# Altium schematic sheet Interfaces_Isolation.SchDoc
size 508 x 292 mm; SheetNumber: 3; SheetTotal: 8
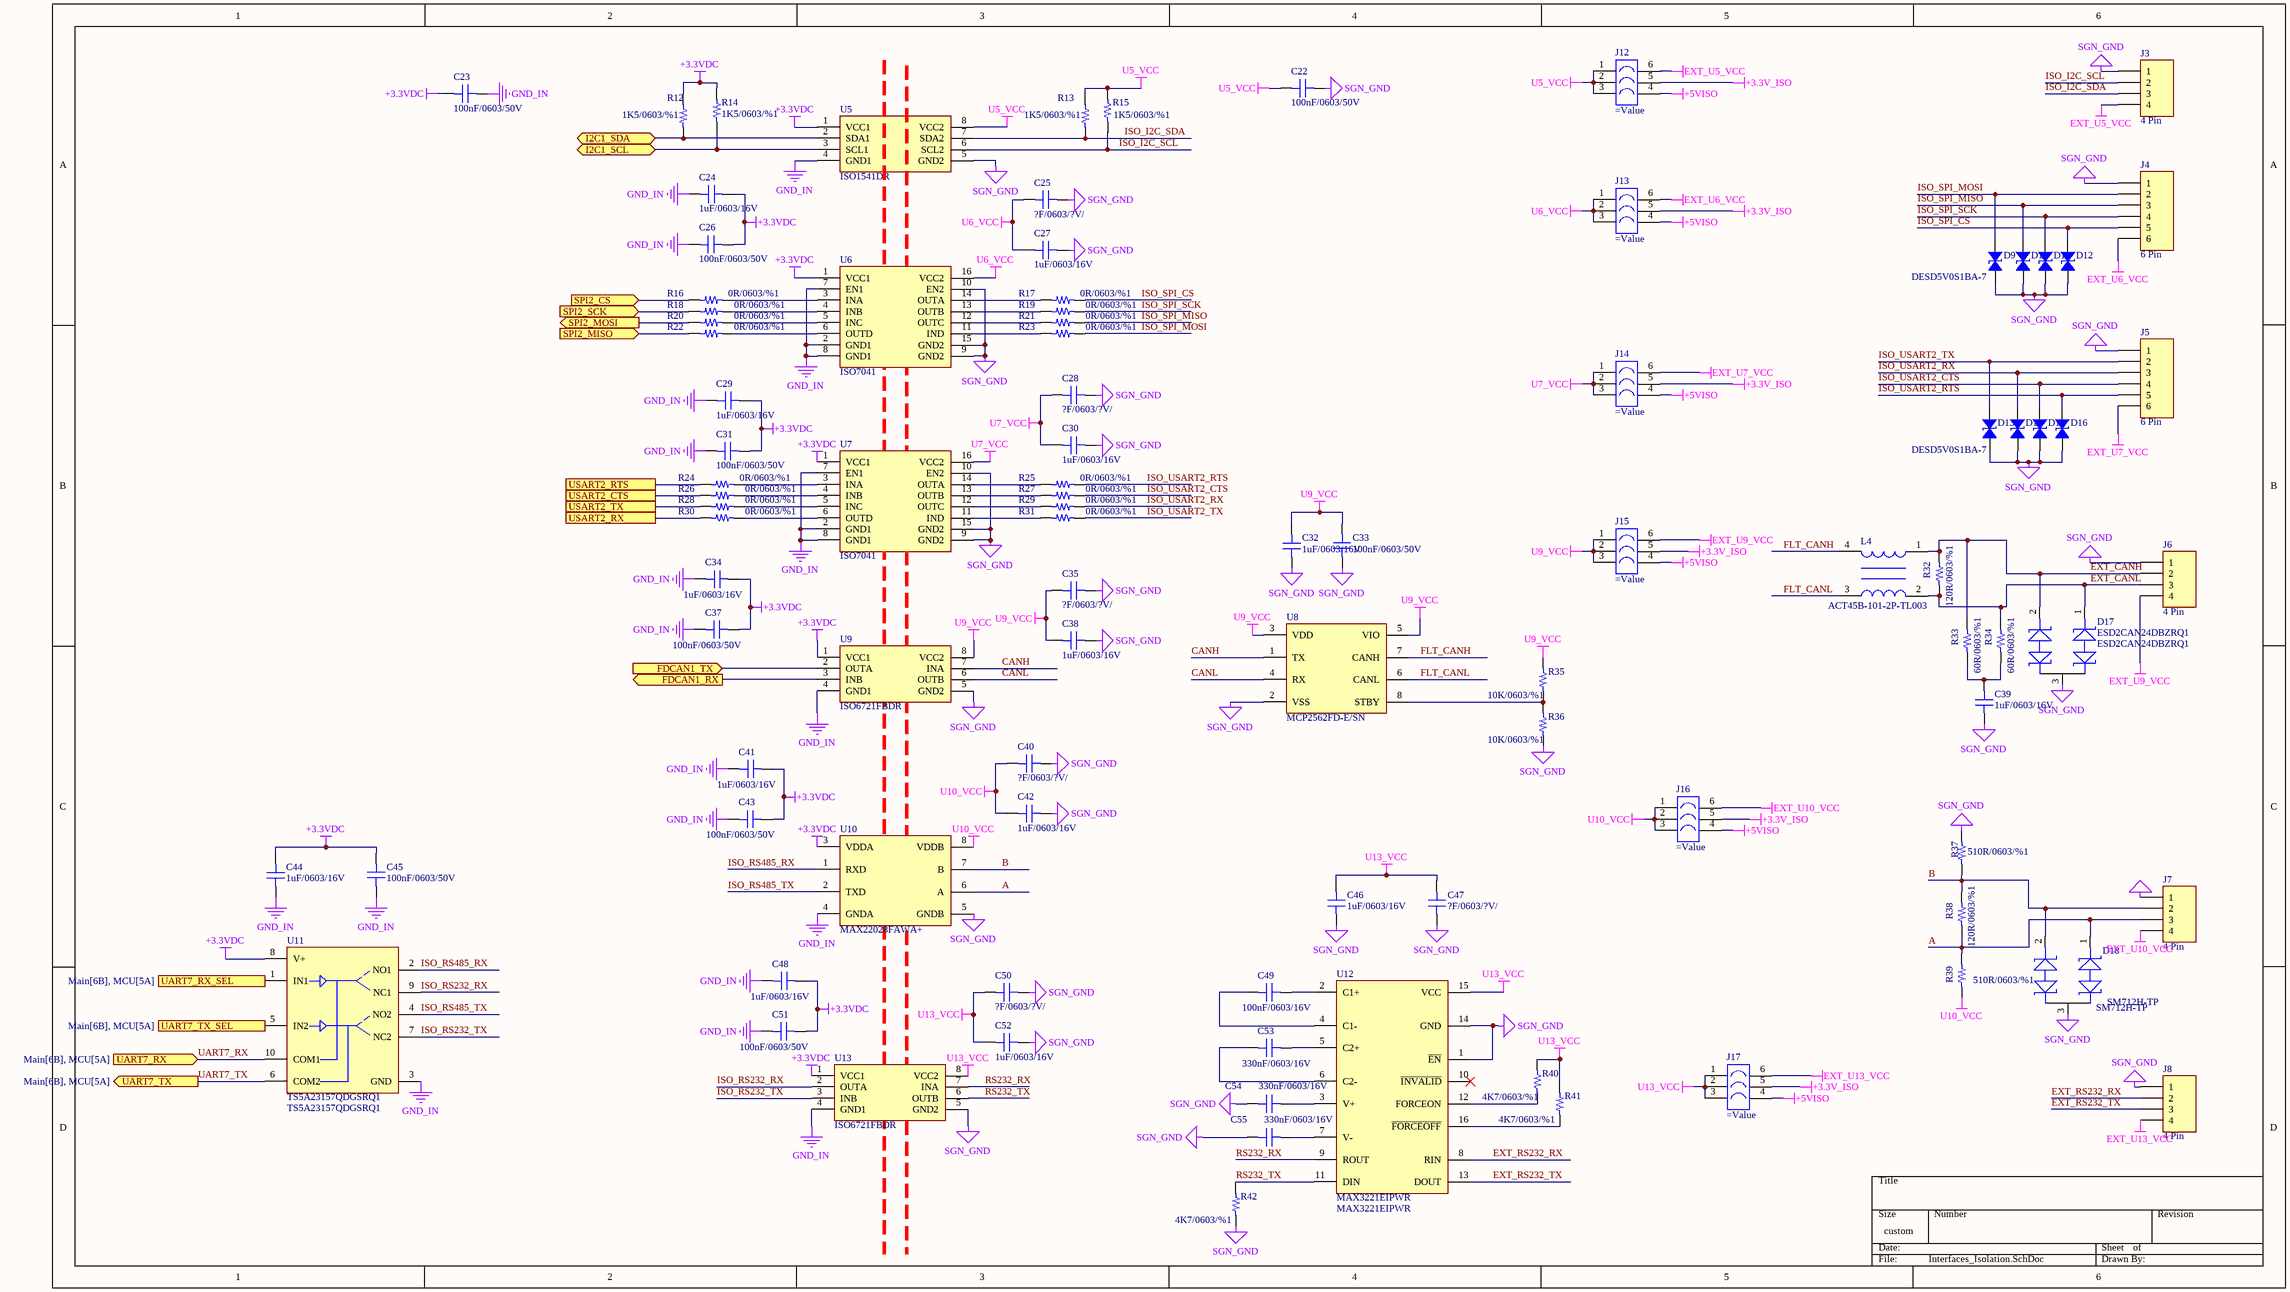
[diagram p0: Interfaces_Isolation.SchDoc]

## Parts
C22  100nF/0603/50V  [0603_cap]
C23  100nF/0603/50V  [0603_cap]
C24  1uF/0603/16V  [0603_cap]
C25  ?F/0603/?V/  [0603_cap]
C26  100nF/0603/50V  [0603_cap]
C27  1uF/0603/16V  [0603_cap]
C28  ?F/0603/?V/  [0603_cap]
C29  1uF/0603/16V  [0603_cap]
C30  1uF/0603/16V  [0603_cap]
C31  100nF/0603/50V  [0603_cap]
C32  1uF/0603/16V  [0603_cap]
C33  100nF/0603/50V  [0603_cap]
C34  1uF/0603/16V  [0603_cap]
C35  ?F/0603/?V/  [0603_cap]
C37  100nF/0603/50V  [0603_cap]
C38  1uF/0603/16V  [0603_cap]
C39  1uF/0603/16V  [0603_cap]
C40  ?F/0603/?V/  [0603_cap]
C41  1uF/0603/16V  [0603_cap]
C42  1uF/0603/16V  [0603_cap]
C43  100nF/0603/50V  [0603_cap]
C44  1uF/0603/16V  [0603_cap]
C45  100nF/0603/50V  [0603_cap]
C46  1uF/0603/16V  [0603_cap]
C47  ?F/0603/?V/  [0603_cap]
C48  1uF/0603/16V  [0603_cap]
C49  100nF/0603/16V  [0603_cap]
C50  ?F/0603/?V/  [0603_cap]
C51  100nF/0603/50V  [0603_cap]
C52  1uF/0603/16V  [0603_cap]
C53  330nF/0603/16V  [0603_cap]
C54  330nF/0603/16V  [0603_cap]
C55  330nF/0603/16V  [0603_cap]
D9  DESD5V0S1BA-7  [SOD323]
D10  DESD5V0S1BA-7  [SOD323]  (value not drawn)
D11  DESD5V0S1BA-7  [SOD323]  (value not drawn)
D12  DESD5V0S1BA-7  [SOD323]  (value not drawn)
D13  DESD5V0S1BA-7  [SOD323]
D14  DESD5V0S1BA-7  [SOD323]  (value not drawn)
D15  DESD5V0S1BA-7  [SOD323]  (value not drawn)
D16  DESD5V0S1BA-7  [SOD323]  (value not drawn)
D17  ESD2CAN24DBZRQ1  [TI SOT-23-3 DBZ]
D18  SM712H-TP  [TI SOT-23-3 DBZ]
J3  4 Pin  [R/A HEADER (4PİN)]
J4  6 Pin  [R/A HEADER]
J5  6 Pin  [R/A HEADER]
J6  4 Pin  [R/A HEADER (4PİN)]
J7  4 Pin  [R/A HEADER (4PİN)]
J8  4 Pin  [R/A HEADER (4PİN)]
J12  (no value)  [th_ra_6pins_1.27mm]
J13  (no value)  [th_ra_6pins_1.27mm]
J14  (no value)  [th_ra_6pins_1.27mm]
J15  (no value)  [th_ra_6pins_1.27mm]
J16  (no value)  [th_ra_6pins_1.27mm]
J17  (no value)  [th_ra_6pins_1.27mm]
L4  ACT45B-101-2P-TL003  [CMC((4.50mm x 3.20mm))]
R12  1K5/0603/%1  [0603_res]
R13  1K5/0603/%1  [0603_res]
R14  1K5/0603/%1  [0603_res]
R15  1K5/0603/%1  [0603_res]
R16  0R/0603/%1  [0603_res]
R17  0R/0603/%1  [0603_res]
R18  0R/0603/%1  [0603_res]
R19  0R/0603/%1  [0603_res]
R20  0R/0603/%1  [0603_res]
R21  0R/0603/%1  [0603_res]
R22  0R/0603/%1  [0603_res]
R23  0R/0603/%1  [0603_res]
R24  0R/0603/%1  [0603_res]
R25  0R/0603/%1  [0603_res]
R26  0R/0603/%1  [0603_res]
R27  0R/0603/%1  [0603_res]
R28  0R/0603/%1  [0603_res]
R29  0R/0603/%1  [0603_res]
R30  0R/0603/%1  [0603_res]
R31  0R/0603/%1  [0603_res]
R32  120R/0603/%1  [0603_res]
R33  60R/0603/%1  [0603_res]
R34  60R/0603/%1  [0603_res]
R35  10K/0603/%1  [0603_res]
R36  10K/0603/%1  [0603_res]
R37  510R/0603/%1  [0603_res]
R38  120R/0603/%1  [0603_res]
R39  510R/0603/%1  [0603_res]
R40  4K7/0603/%1  [0603_res]
R41  4K7/0603/%1  [0603_res]
R42  4K7/0603/%1  [0603_res]
U5  ISO1541DR  [SOIC-8(3.90MM)]
U6  ISO7041  [16-SSOP (0.154", 3.90mm Width)]
U7  ISO7041  [16-SSOP (0.154", 3.90mm Width)]
U8  MCP2562FD-E/SN  [SOIC-8(3.90MM)]
U9  ISO6721FBDR  [SOIC-8(3.90MM)]
U10  MAX22028FAWA+  [8-SOIC (0.209", 5.30mm Width)]
U11  TS5A23157QDGSRQ1  [VSSOP-10]
U12  MAX3221EIPWR  [16-TSSOP]
U13  ISO6721FBDR  [SOIC-8(3.90MM)]

## Ports
FDCAN1_RX (out, see Main[6B], MCU[3A]), FDCAN1_TX (in, see Main[6B], MCU[3A]), I2C1_SCL (bidir, see Main[6A], MCU[6A]), I2C1_SDA (bidir, see Main[6A], MCU[6A]), SPI2_CS (in, see Main[6B], MCU[6A]), SPI2_MISO (in, see Main[6A], MCU[6A]), SPI2_MOSI (out, see Main[6A], MCU[6A]), SPI2_SCK (in, see Main[6A], MCU[6A]), UART7_RX (in, see Main[6B], MCU[5A]), UART7_RX_SEL (in, see Main[6B], MCU[5A]), UART7_TX (out, see Main[6B], MCU[5A]), UART7_TX_SEL (in, see Main[6B], MCU[5A]), USART2_CTS (see Main[6A], MCU[4A]), USART2_RTS (see Main[6B], MCU[4A]), USART2_RX (see Main[6B], MCU[4A]), USART2_TX (see Main[6B], MCU[4A])

## Nets
+3.3V_ISO: J12.5 J13.5 J14.5 J15.5 J16.5 J17.5
+3.3VDC: C23.2 C24.2 C26.1 C29.2 C31.1 C34.2 C37.1 C41.2 C43.1 C44.2 C45.1 C48.2 C51.1 R12.2 R14.1 U5.1(VCC1) U6.1(VCC1) U7.1(VCC1) U9.1(VCC1) U10.3(VDDA) U11.8(V+) U13.1(VCC1)
+5VISO: J12.4 J13.4 J14.4 J15.4 J16.4 J17.4
EXT_U5_VCC: J3.4 J12.6
EXT_U6_VCC: J4.6 J13.6
EXT_U7_VCC: J5.6 J14.6
EXT_U9_VCC: J6.4 J15.6
EXT_U10_VCC: J7.4 J16.6
EXT_U13_VCC: J8.4 J17.6
GND_IN: C23.1 C24.1 C26.2 C29.1 C31.2 C34.1 C37.2 C41.1 C43.2 C44.1 C45.2 C48.1 C51.2 U5.4(GND1) U6.2(GND1) U6.7(EN1) U6.8(GND1) U7.2(GND1) U7.7(EN1) U7.8(GND1) U9.4(GND1) U10.4(GNDA) U11.3(GND) U13.4(GND1)
SGN_GND: C22.1 C25.1 C27.1 C28.1 C30.1 C32.1 C33.2 C35.1 C38.1 C39.1 C40.1 C42.1 C46.1 C47.1 C50.1 C52.1 C54.2 C55.2 D9.1 D10.1 D11.1 D12.1 D13.1 D14.1 D15.1 D16.1 D17.3 D18.3 J3.1 J4.1 J5.1 J6.1 J7.1 J8.1 R36.2 R37.1 R42.2 U5.5(GND2) U6.9(GND2) U6.10(EN2) U6.15(GND2) U7.9(GND2) U7.10(EN2) U7.15(GND2) U8.2(VSS) U9.5(GND2) U10.5(GNDB) U12.1(~{EN}) U12.14(GND) U13.5(GND2)
U5_VCC: C22.2 J12.1 J12.2 J12.3 R13.2 R15.1 U5.8(VCC2)
U6_VCC: C25.2 C27.2 J13.1 J13.2 J13.3 U6.16(VCC2)
U7_VCC: C28.2 C30.2 J14.1 J14.2 J14.3 U7.16(VCC2)
U9_VCC: C32.2 C33.1 C35.2 C38.2 J15.1 J15.2 J15.3 R35.1 U8.3(VDD) U8.5(VIO) U9.8(VCC2)
U10_VCC: C40.2 C42.2 J16.1 J16.2 J16.3 R39.2 U10.8(VDDB)
U13_VCC: C46.2 C47.2 C50.2 C52.2 J17.1 J17.2 J17.3 R40.1 R41.1 U12.15(VCC) U13.8(VCC2)
A: D18.1 J7.3 R38.2 R39.1 U10.6(A)
B: D18.2 J7.2 R37.2 R38.1 U10.7(B)
CANH: U8.1(TX) U9.7(INA)
CANL: U8.4(RX) U9.6(OUTB)
EXT_CANH: D17.2 J6.2 L4.1 R32.1 R33.1
EXT_CANL: D17.1 J6.3 L4.2 R32.2 R34.1
EXT_RS232_RX: J8.2 U12.8(RIN)
EXT_RS232_TX: J8.3 U12.13(DOUT)
FDCAN1_RX: U9.3(INB) ; port FDCAN1_RX
FDCAN1_TX: U9.2(OUTA) ; port FDCAN1_TX
FLT_CANH: L4.4 U8.7(CANH)
FLT_CANL: L4.3 U8.6(CANL)
I2C1_SCL: R14.2 U5.3(SCL1) ; port I2C1_SCL
I2C1_SDA: R12.1 U5.2(SDA1) ; port I2C1_SDA
ISO_I2C_SCL: J3.2 R15.2 U5.6(SCL2)
ISO_I2C_SDA: J3.3 R13.1 U5.7(SDA2)
ISO_RS232_RX: U11.9(NC1) U13.2(OUTA)
ISO_RS232_TX: U11.7(NC2) U13.3(INB)
ISO_RS485_RX: U10.1(RXD) U11.2(NO1)
ISO_RS485_TX: U10.2(TXD) U11.4(NO2)
ISO_SPI_CS: D12.2 J4.5 R17.1
ISO_SPI_MISO: D10.2 J4.3 R21.1
ISO_SPI_MOSI: D9.2 J4.2 R23.1
ISO_SPI_SCK: D11.2 J4.4 R19.1
ISO_USART2_CTS: D15.2 J5.4 R27.1
ISO_USART2_RTS: D16.2 J5.5 R25.1
ISO_USART2_RX: D14.2 J5.3 R29.1
ISO_USART2_TX: D13.2 J5.2 R31.1
RS232_RX: U12.9(ROUT) U13.7(INA)
RS232_TX: R42.1 U12.11(DIN) U13.6(OUTB)
SPI2_CS: R16.2 ; port SPI2_CS
SPI2_MISO: R22.2 ; port SPI2_MISO
SPI2_MOSI: R20.2 ; port SPI2_MOSI
SPI2_SCK: R18.2 ; port SPI2_SCK
UART7_RX: U11.10(COM1) ; port UART7_RX
UART7_RX_SEL: U11.1(IN1) ; port UART7_RX_SEL
UART7_TX: U11.6(COM2) ; port UART7_TX
UART7_TX_SEL: U11.5(IN2) ; port UART7_TX_SEL
USART2_CTS: R26.2 ; port USART2_CTS
USART2_RTS: R24.2 ; port USART2_RTS
USART2_RX: R30.2 ; port USART2_RX
USART2_TX: R28.2 ; port USART2_TX
NetC39_2: C39.2 R33.2 R34.2
NetC49_1: C49.1 U12.2(C1+)
NetC49_2: C49.2 U12.4(C1-)
NetC53_1: C53.1 U12.5(C2+)
NetC53_2: C53.2 U12.6(C2-)
NetC54_1: C54.1 U12.3(V+)
NetC55_1: C55.1 U12.7(V-)
NetR16_1: R16.1 U6.3(INA)
NetR17_2: R17.2 U6.14(OUTA)
NetR18_1: R18.1 U6.4(INB)
NetR19_2: R19.2 U6.13(OUTB)
NetR20_1: R20.1 U6.5(INC)
NetR21_2: R21.2 U6.12(OUTC)
NetR22_1: R22.1 U6.6(OUTD)
NetR23_2: R23.2 U6.11(IND)
NetR24_1: R24.1 U7.3(INA)
NetR25_2: R25.2 U7.14(OUTA)
NetR26_1: R26.1 U7.4(INB)
NetR27_2: R27.2 U7.13(OUTB)
NetR28_1: R28.1 U7.5(INC)
NetR29_2: R29.2 U7.12(OUTC)
NetR30_1: R30.1 U7.6(OUTD)
NetR31_2: R31.2 U7.11(IND)
NetR35_2: R35.2 R36.1 U8.8(STBY)
NetR40_2: R40.2 U12.12(FORCEON)
NetR41_2: R41.2 U12.16(~{FORCEOFF})

Not connected (* = marked no-connect by the designer): U12 10(~{INVALID})*

## Library data of the parts
C22-C35 C37-C55 = Capacitor: HelpURL: *; PN: *; Assembly: *
  C22 C23 C26 C31 C33 C37 C43 C45 C51: Value: 100nF/0603/50V
  C24 C27 C29 C30 C32 C34 C38 C39 C41 C42 C44 C46 C48 C52: Value: 1uF/0603/16V
  C25 C28 C35 C40 C47 C50: Value: ?F/0603/?V/
  C49: Value: 100nF/0603/16V
  C53-C55: Value: 330nF/0603/16V
D9-D16 = TVS BI: Zener Diode; Assembly: .; HelpURL: https://www.digikey.com/en/products/detail/diodes-incorporated/DESD5V0S1BA-7/3451477?s=N4IgTCBcDaICIFEDKcCsA1ADEgjAIQEEBaAdhAF0BfIA; PN: DESD5V0S1BA-7; Value: DESD5V0S1BA-7
D17 = SM712H-TP: 37V (Typ) Clamp 5.7A (8/20µs) Ipp Tvs Diode Surface Mount SOT-23-3; Assembly: .; HelpURL: https://www.digikey.com/en/products/detail/texas-instruments/ESD2CAN24DBZRQ1/16982061; PN: ESD2CAN24DBZRQ1; Value: ESD2CAN24DBZRQ1
D18 = SM712H-TP: TVS DIODE 12VWM 28VC SOT23; Assembly: .; HelpURL: https://www.digikey.com/en/products/detail/mcc-micro-commercial-components/SM712H-TP/12177158; PN: SM712H-TP; Value: SM712H-TP
J3 J6-J8 = 4 Pin: Value: 2EDGRC-5.08-04P; Assembly: .; PN: 2EDGRC-5.08-04P; HelpURL: https://www.ozdisan.com/p/gecmeli-klemensler-411/degson-2edgrc-5-08-04p-14-00ah-445450
J4 J5 = 6 Pin: Assembly: .; PN: 2EDGRC-5.08-04P-14-00AH; Value: 2EDGRC-5.08-04P-14-00AH; HelpURL: https://www.ozdisan.com/p/gecmeli-klemensler-411/degson-2edgrc-5-08-04p-14-00ah-445450
J12-J17 = 2x3_header
L4 = cmc: 100 µH @ 100 kHz 2 Line Common Mode Choke Surface Mount 5.8 kOhms @ 10 MHz 150mA DCR 2Ohm; Assembly: .; Help URL: https://www.digikey.com/en/products/detail/tdk-corporation/ACT45B-101-2P-TL003/1950643?s=N4IgTCBcDaIIIGEAqAWArAIQLQEYAMOWYAClkgDJ54DMIAugL5A; PN: ACT45B-101-2P-TL003; Value: ACT45B-101-2P-TL003
R12-R42 = RES: Assembly: .; HelpURL: *; PN: *
  R12-R15: Value: 1K5/0603/%1
  R16-R31: Value: 0R/0603/%1
  R32 R38: Value: 120R/0603/%1
  R33 R34: Value: 60R/0603/%1
  R35 R36: Value: 10K/0603/%1
  R37 R39: Value: 510R/0603/%1
  R40-R42: Value: 4K7/0603/%1
U5 = TI ISO154x: I2C Digital Isolator 2500Vrms 2 Channel 1Mbps 25kV/µs CMTI 8-SOIC (0.154", 3.90mm Width); Assembly: .; PN: ISO1541DR; Value: ISO1541DR; HelpURL: https://www.digikey.com/en/products/detail/texas-instruments/ISO1541DR/3587223?s=N4IgTCBcDaIJIGUDyBGArAFhQEQEogF0BfIA
U6 U7 = ISO7041: SPI Digital Isolator 3000Vrms 4 Channel 2Mbps 50kV/µs CMTI 16-SSOP (0.154", 3.90mm Width); Value: ISO7041DBQR; Assembly: .; PN: ISO7041DBQR; HelpURL: https://www.digikey.com/en/products/detail/texas-instruments/ISO7041DBQR/10448338
U8 = MCP2562FD-E/SN: 1/1 Transceiver CANbus 8-SOIC; Assembly: .; HelpURL: https://www.digikey.com/en/products/detail/microchip-technology/MCP2562FD-E-SN/4842808; PN: MCP2562FD-E/SN; Value: MCP2562FD-E/SN
U9 = ISO6721FBDR: CAN, RS232, RS485, SPI Digital Isolator 3000Vrms 2 Channel 50Mbps 100kV/µs CMTI 8-SOIC (0.154", 3.90mm Width); Assembly: .; HelpURL: https://www.digikey.com/en/products/detail/texas-instruments/ISO6721FBDR/13627193?s=N4IgTCBcDaIJIGUDyA2A7GAjAMQEIBEAlEAXQF8g; PN: ISO6721FBDR; Value: ISO6721FBDR
U10 = MAX22028FAWA+: 1/1 Transceiver, Isolated Half RS422, RS485 8-SOIC; Assembly: .; PN: MAX22028FAWA+; HelpURL: https://www.digikey.com/en/products/detail/analog-devices-inc-maxim-integrated/MAX22028FAWA/15652899; Value: MAX22028FAWA+
U11 = TS5A23157QDGSRQ1: IC SWITCH SPDT X 2 15OHM 10VSSOP; Assembly: .; PN: TS5A23157QDGSRQ1; HelpURL: https://www.digikey.com/en/products/detail/texas-instruments/TS5A23157QDGSRQ1/3996775; Value: TS5A23157QDGSRQ1
U12 = MAX3221EIPWR: IC TRANSCEIVER FULL 1/1 16TSSOP; Assembly: .; PN: MAX3221EIPWR; HelpURL: https://www.digikey.com/en/products/detail/texas-instruments/MAX3221EIPWR/964660?s=N4IgTCBcDaILIEEAaBmMYCMBRAkgBQHUAlEAXQF8g; Value: MAX3221EIPWR
U13 = ISO6721FBDR: CAN, RS232, RS485, SPI Digital Isolator 3000Vrms 2 Channel 50Mbps 100kV/µs CMTI 8-SOIC (0.154", 3.90mm Width); Assembly: *; HelpURL: https://www.digikey.com/en/products/detail/texas-instruments/ISO6721FBDR/13627193?s=N4IgTCBcDaIJIGUDyA2A7GAjAMQEIBEAlEAXQF8g; PN: ISO6721FBDR; Value: ISO6721FBDR